# Altium schematic sheet Main.SchDoc: MCU - Top Sheet
size A3; Author: Eladio Delgado Mingorance; CompanyName: bq - Mundo Reader; Organization: bq - Mundo Reader; Revision: 1.4; SheetNumber: 1; SheetTotal: 10
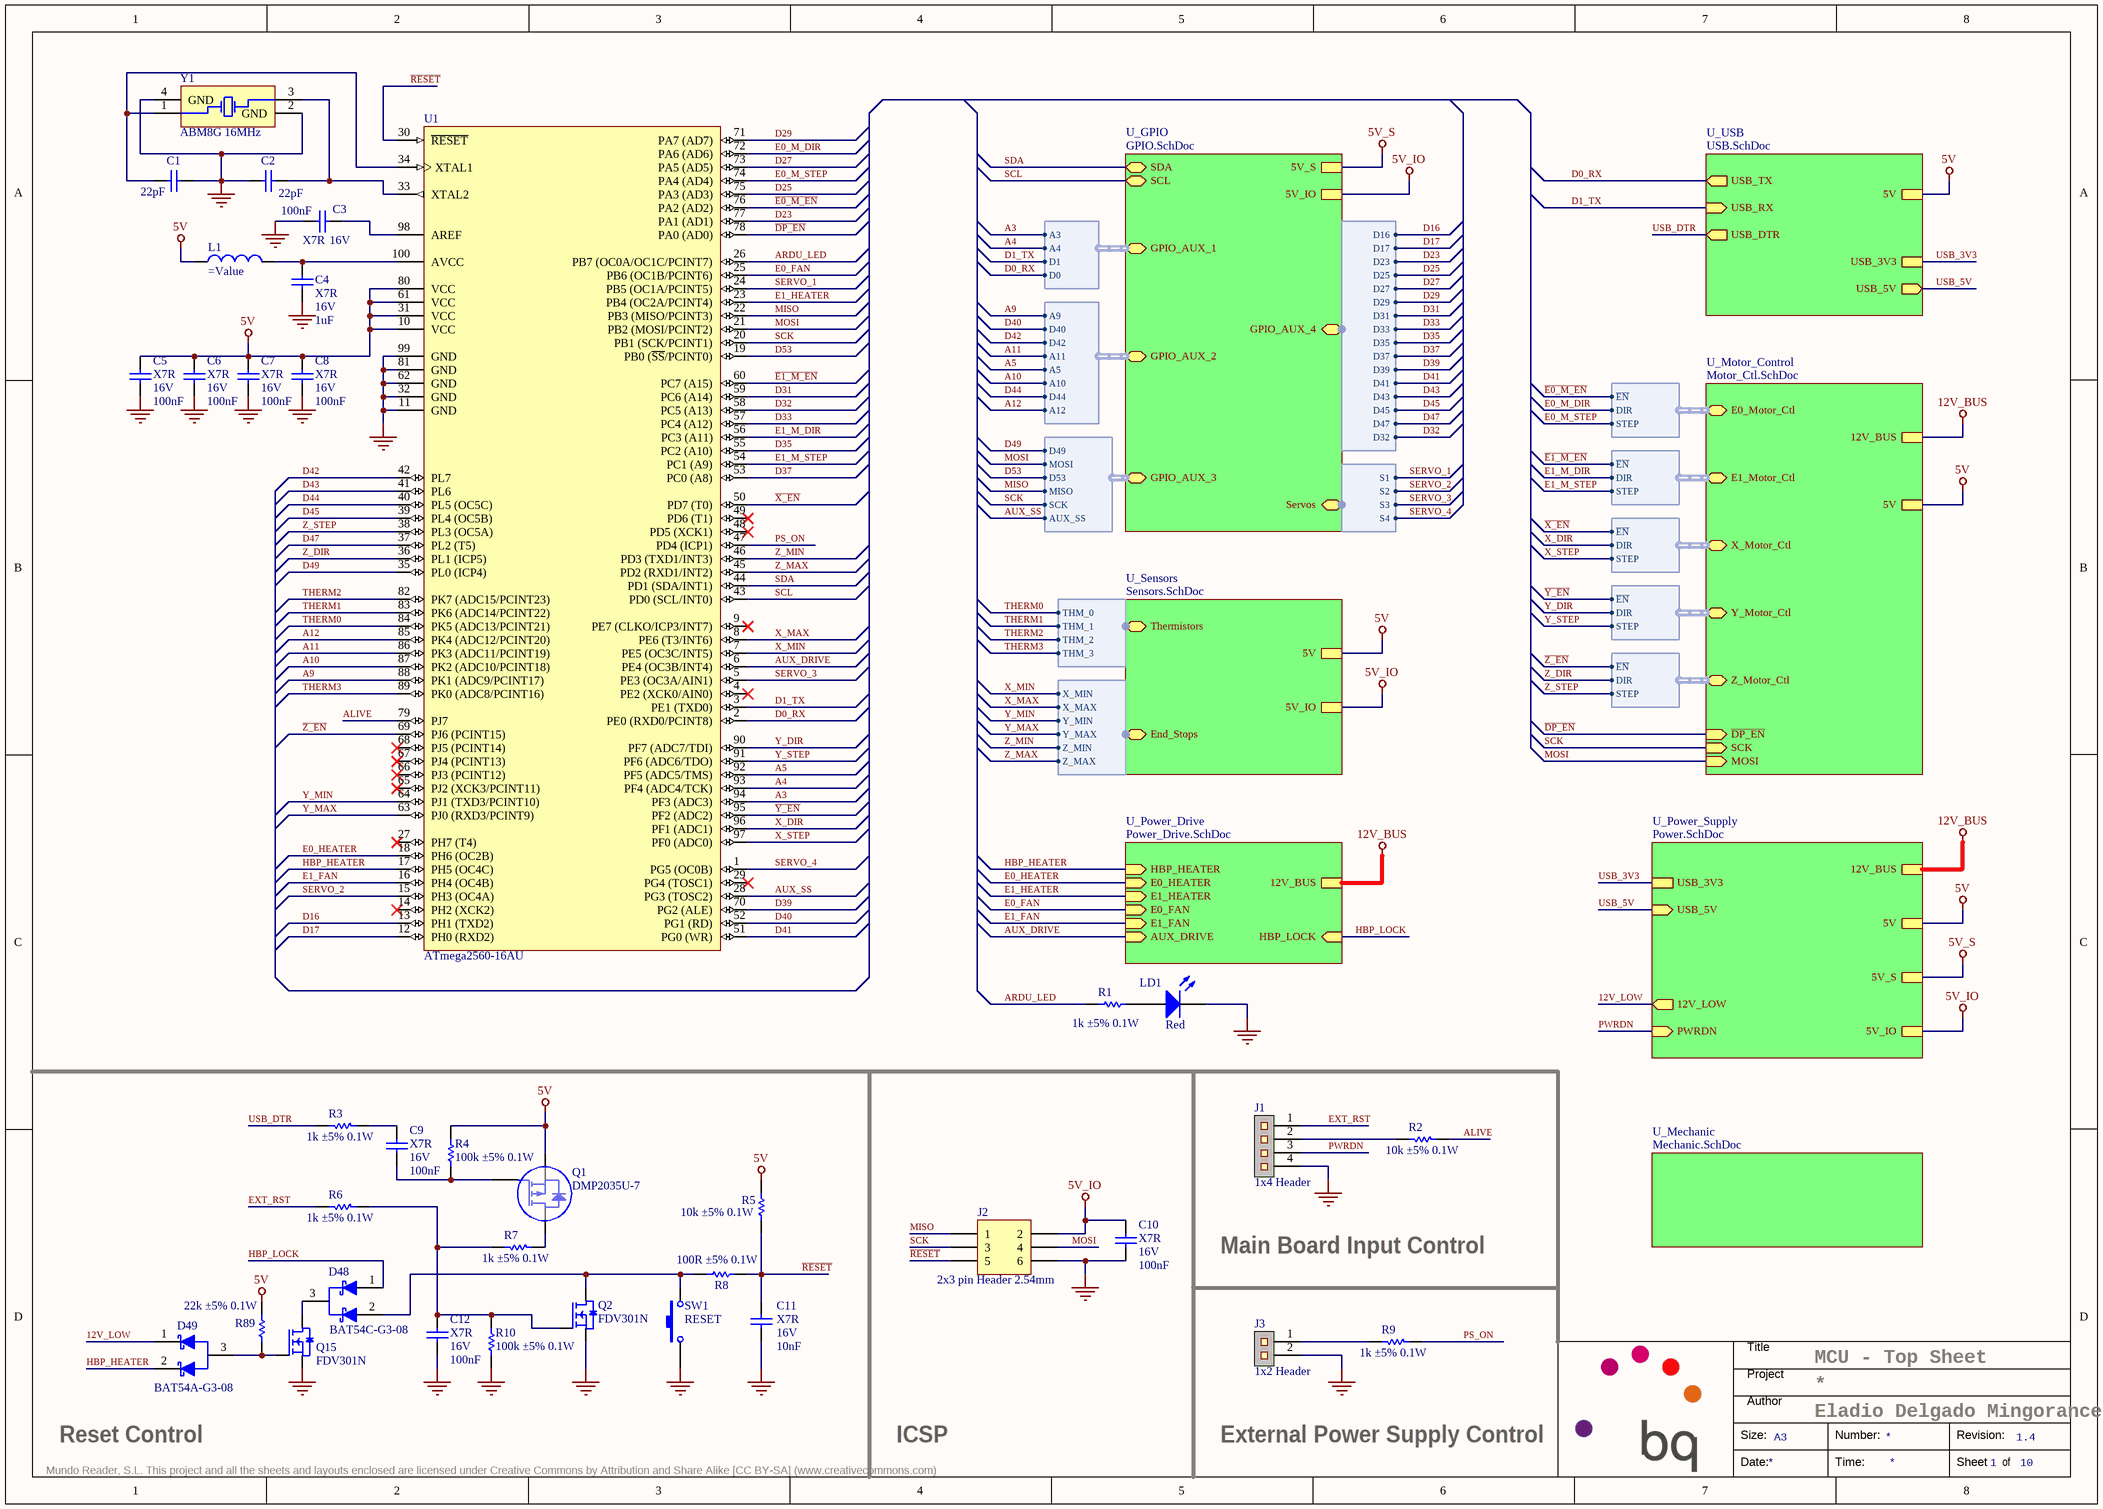
[diagram p0: Main.SchDoc]

## Parts
C1  Capacitance: 22pF  [C0603]  (hidden comment: Capacitor)
C2  Capacitance: 22pF  [C0603]  (hidden comment: Capacitor)
C3  Dielectric: X7R  Voltage: 16V  Capacitance: 100nF  [C0603]  (hidden comment: Capacitor)
C4  Dielectric: X7R  Voltage: 16V  Capacitance: 1uF  [C0603]  (hidden comment: Capacitor)
C5  Dielectric: X7R  Voltage: 16V  Capacitance: 100nF  [C0603]  (hidden comment: Capacitor)
C6  Dielectric: X7R  Voltage: 16V  Capacitance: 100nF  [C0603]  (hidden comment: Capacitor)
C7  Dielectric: X7R  Voltage: 16V  Capacitance: 100nF  [C0603]  (hidden comment: Capacitor)
C8  Dielectric: X7R  Voltage: 16V  Capacitance: 100nF  [C0603]  (hidden comment: Capacitor)
C9  Dielectric: X7R  Voltage: 16V  Capacitance: 100nF  [C0603]  (hidden comment: Capacitor)
C10  Dielectric: X7R  Voltage: 16V  Capacitance: 100nF  [C0603]  (hidden comment: Capacitor)
C11  Dielectric: X7R  Voltage: 16V  Capacitance: 10nF  [C0603]  (hidden comment: Capacitor)
C12  Dielectric: X7R  Voltage: 16V  Capacitance: 100nF  [C0603]  (hidden comment: Capacitor)
D48  BAT54C-G3-08  [SOT23-3]
D49  BAT54A-G3-08  [SOT23-3]
J1  1x4 Header  [1x4 MTE Straight Header 2.54mm]
J2  2x3 pin Header 2.54mm  [2x3 Pin Header 2.54]
J3  1x2 Header  [1x2 MTE Straight Header 2.54mm]
L1  (no value)  [L0805]
LD1  Red  [LED0603]
Q1  DMP2035U-7  [SOT23-3]
Q2  FDV301N  [SOT23-3]
Q15  FDV301N  [SOT23-3]
R1  value 1k ±5% 0.1W  [R0603]  (hidden comment: Resistor)
R2  value 10k ±5% 0.1W  [R0603]  (hidden comment: Resistor)
R3  value 1k ±5% 0.1W  [R0603]  (hidden comment: Resistor)
R4  value 100k ±5% 0.1W  [R0603]  (hidden comment: Resistor)
R5  value 10k ±5% 0.1W  [R0603]  (hidden comment: Resistor)
R6  value 1k ±5% 0.1W  [R0603]  (hidden comment: Resistor)
R7  value 1k ±5% 0.1W  [R0603]  (hidden comment: Resistor)
R8  value 100R ±5% 0.1W  [R0603]  (hidden comment: Resistor)
R9  value 1k ±5% 0.1W  [R0603]  (hidden comment: Resistor)
R10  value 100k ±5% 0.1W  [R0603]  (hidden comment: Resistor)
R89  value 22k ±5% 0.1W  [R0603]  (hidden comment: Resistor)
SW1  RESET  [SW_Vert_THT_7.5x6x6.5]
U1  ATmega2560-16AU  [TQFP100_05_MD]
Y1  ABM8G 16MHz  [ABM8G_3.2x2.5mm]

## Sub-sheets
U_GPIO = GPIO.SchDoc: GPIO_AUX_4 (harness GPIO_AUX_4), Servos (harness Servos), SDA (bidir), SCL (bidir), 5V_S, 5V_IO, GPIO_AUX_1 (harness GPIO_AUX_1), GPIO_AUX_2 (harness GPIO_AUX_2), GPIO_AUX_3 (harness GPIO_AUX_3)
U_Mechanic = Mechanic.SchDoc: no entries
U_Motor_Control = Motor_Ctl.SchDoc: E0_Motor_Ctl (harness Motor_Ctl), E1_Motor_Ctl (harness Motor_Ctl), X_Motor_Ctl (harness Motor_Ctl), Y_Motor_Ctl (harness Motor_Ctl), Z_Motor_Ctl (harness Motor_Ctl), ~{DP_EN} (in), SCK (in), MOSI (in), 12V_BUS, 5V
U_Power_Drive = Power_Drive.SchDoc: 12V_BUS, E0_HEATER (in), E1_HEATER (in), HBP_HEATER (in), E0_FAN (in), E1_FAN (in), AUX_DRIVE (in), HBP_LOCK (in)
U_Power_Supply = Power.SchDoc: 5V, 5V_S, 5V_IO, 12V_BUS, USB_3V3, USB_5V (in), PWRDN (in), 12V_LOW (out)
U_Sensors = Sensors.SchDoc: Thermistors (harness Thermistors), End_Stops (harness End_Stops), 5V, 5V_IO
U_USB = USB.SchDoc: USB_TX (out), USB_RX (in), USB_DTR (out), USB_3V3, USB_5V (out), 5V

## Harnesses
Motor_Ctl: ~{EN}, DIR, STEP
Thermistors: THM_0, THM_1, THM_2, THM_3
End_Stops: X_MIN, X_MAX, Y_MAX, Y_MIN, Z_MIN, Z_MAX
GPIO_AUX_4: D16, D17, D23, D25, D27, D29, D31, D33, D35, D37, D39, D41, D43, D45, D47, D32
Servos: S1, S2, S3, S4
GPIO_AUX_1: A3, A4, D0, D1
GPIO_AUX_2: A5, A10, D44, A12, A9, D40, D42, A11
GPIO_AUX_3: D49, MOSI, D53, MISO, SCK, AUX_SS

## Nets
5V: C5.2 C6.2 C7.2 C8.2 L1.1 Q1.2(S) R4.2 R5.2 R89.2 U1.10(VCC) U1.31(VCC) U1.61(VCC) U1.80(VCC) ; sheet U_Power_Supply/5V, sheet U_Motor_Control/5V, sheet U_Sensors/5V, sheet U_USB/5V
5V_IO: C10.2 J2.2 ; sheet U_Power_Supply/5V_IO, sheet U_Sensors/5V_IO, sheet U_GPIO/5V_IO
5V_S: sheet U_Power_Supply/5V_S, sheet U_GPIO/5V_S
12V_BUS: sheet U_Power_Supply/12V_BUS, sheet U_Motor_Control/12V_BUS, sheet U_Power_Drive/12V_BUS
GND: C1.1 C2.1 C3.2 C4.1 C5.1 C6.1 C7.1 C8.1 C10.1 C11.1 C12.1 J1.4 J2.6 J3.2 LD1.K Q2.2(S) Q15.2(S) R10.1 SW1.1 U1.11(GND) U1.32(GND) U1.62(GND) U1.81(GND) U1.99(GND) Y1.2(GND) Y1.4(GND)
12V_LOW: D49.1(A1) ; sheet U_Power_Supply/12V_LOW
~{DP_EN}: U1.78(PA0_(AD0)) ; sheet U_Motor_Control/~{DP_EN}
~{E0_M_EN}: U1.76(PA2_(AD2)) ; sheet U_Motor_Control/E0_Motor_Ctl.~{EN}
~{E1_M_EN}: U1.60(PC7_(A15)) ; sheet U_Motor_Control/E1_Motor_Ctl.~{EN}
~{RESET}: C11.2 J2.5 R5.1 R8.2 U1.30(~{RESET})
~{X_EN}: U1.50(PD7_(T0)) ; sheet U_Motor_Control/X_Motor_Ctl.~{EN}
~{Y_EN}: U1.95(PF2_(ADC2)) ; sheet U_Motor_Control/Y_Motor_Ctl.~{EN}
~{Z_EN}: U1.69(PJ6_(PCINT15)) ; sheet U_Motor_Control/Z_Motor_Ctl.~{EN}
A3: U1.94(PF3_(ADC3)) ; sheet U_GPIO/GPIO_AUX_1.A3
A4: U1.93(PF4_(ADC4/TCK)) ; sheet U_GPIO/GPIO_AUX_1.A4
A5: U1.92(PF5_(ADC5/TMS)) ; sheet U_GPIO/GPIO_AUX_2.A5
A9: U1.88(PK1_(ADC9/PCINT17)) ; sheet U_GPIO/GPIO_AUX_2.A9
A10: U1.87(PK2_(ADC10/PCINT18)) ; sheet U_GPIO/GPIO_AUX_2.A10
A11: U1.86(PK3_(ADC11/PCINT19)) ; sheet U_GPIO/GPIO_AUX_2.A11
A12: U1.85(PK4_(ADC12/PCINT20)) ; sheet U_GPIO/GPIO_AUX_2.A12
ALIVE: R2.1 U1.79(PJ7)
ARDU_LED: R1.1 U1.26(PB7_(OC0A/OC1C/PCINT7))
AUX_DRIVE: U1.6(PE4_(OC3B/INT4)) ; sheet U_Power_Drive/AUX_DRIVE
AUX_SS: U1.28(PG3_(TOSC2)) ; sheet U_GPIO/GPIO_AUX_3.AUX_SS
D0_RX: U1.2(PE0_(RXD0/PCINT8)) ; sheet U_USB/USB_TX, sheet U_GPIO/GPIO_AUX_1.D0
D1_TX: U1.3(PE1_(TXD0)) ; sheet U_USB/USB_RX, sheet U_GPIO/GPIO_AUX_1.D1
D16: U1.13(PH1_(TXD2)) ; sheet U_GPIO/GPIO_AUX_4.D16
D17: U1.12(PH0_(RXD2)) ; sheet U_GPIO/GPIO_AUX_4.D17
D23: U1.77(PA1_(AD1)) ; sheet U_GPIO/GPIO_AUX_4.D23
D25: U1.75(PA3_(AD3)) ; sheet U_GPIO/GPIO_AUX_4.D25
D27: U1.73(PA5_(AD5)) ; sheet U_GPIO/GPIO_AUX_4.D27
D29: U1.71(PA7_(AD7)) ; sheet U_GPIO/GPIO_AUX_4.D29
D31: U1.59(PC6_(A14)) ; sheet U_GPIO/GPIO_AUX_4.D31
D32: U1.58(PC5_(A13)) ; sheet U_GPIO/GPIO_AUX_4.D32
D33: U1.57(PC4_(A12)) ; sheet U_GPIO/GPIO_AUX_4.D33
D35: U1.55(PC2_(A10)) ; sheet U_GPIO/GPIO_AUX_4.D35
D37: U1.53(PC0_(A8)) ; sheet U_GPIO/GPIO_AUX_4.D37
D39: U1.70(PG2_(ALE)) ; sheet U_GPIO/GPIO_AUX_4.D39
D40: U1.52(PG1_(RD)) ; sheet U_GPIO/GPIO_AUX_2.D40
D41: U1.51(PG0_(WR)) ; sheet U_GPIO/GPIO_AUX_4.D41
D42: U1.42(PL7) ; sheet U_GPIO/GPIO_AUX_2.D42
D43: U1.41(PL6) ; sheet U_GPIO/GPIO_AUX_4.D43
D44: U1.40(PL5_(OC5C)) ; sheet U_GPIO/GPIO_AUX_2.D44
D45: U1.39(PL4_(OC5B)) ; sheet U_GPIO/GPIO_AUX_4.D45
D47: U1.37(PL2_(T5)) ; sheet U_GPIO/GPIO_AUX_4.D47
D49: U1.35(PL0_(ICP4)) ; sheet U_GPIO/GPIO_AUX_3.D49
D53: U1.19(PB0_(~{SS}/PCINT0)) ; sheet U_GPIO/GPIO_AUX_3.D53
E0_FAN: U1.25(PB6_(OC1B/PCINT6)) ; sheet U_Power_Drive/E0_FAN
E0_HEATER: U1.18(PH6_(OC2B)) ; sheet U_Power_Drive/E0_HEATER
E0_M_DIR: U1.72(PA6_(AD6)) ; sheet U_Motor_Control/E0_Motor_Ctl.DIR
E0_M_STEP: U1.74(PA4_(AD4)) ; sheet U_Motor_Control/E0_Motor_Ctl.STEP
E1_FAN: U1.16(PH4_(OC4B)) ; sheet U_Power_Drive/E1_FAN
E1_HEATER: U1.23(PB4_(OC2A/PCINT4)) ; sheet U_Power_Drive/E1_HEATER
E1_M_DIR: U1.56(PC3_(A11)) ; sheet U_Motor_Control/E1_Motor_Ctl.DIR
E1_M_STEP: U1.54(PC1_(A9)) ; sheet U_Motor_Control/E1_Motor_Ctl.STEP
EXT_RST: J1.1 R6.2
HBP_HEATER: D49.2(A2) U1.17(PH5_(OC4C)) ; sheet U_Power_Drive/HBP_HEATER
HBP_LOCK: D48.1(A1) ; sheet U_Power_Drive/HBP_LOCK
MISO: J2.1 U1.22(PB3_(MISO/PCINT3)) ; sheet U_GPIO/GPIO_AUX_3.MISO
MOSI: J2.4 U1.21(PB2_(MOSI/PCINT2)) ; sheet U_Motor_Control/MOSI, sheet U_GPIO/GPIO_AUX_3.MOSI
PS_ON: R9.1 U1.47(PD4_(ICP1))
PWRDN: J1.3 ; sheet U_Power_Supply/PWRDN
SCK: J2.3 U1.20(PB1_(SCK/PCINT1)) ; sheet U_Motor_Control/SCK, sheet U_GPIO/GPIO_AUX_3.SCK
SCL: U1.43(PD0_(SCL/INT0)) ; sheet U_GPIO/SCL
SDA: U1.44(PD1_(SDA/INT1)) ; sheet U_GPIO/SDA
SERVO_1: U1.24(PB5_(OC1A/PCINT5)) ; sheet U_GPIO/Servos.S1
SERVO_2: U1.15(PH3_(OC4A)) ; sheet U_GPIO/Servos.S2
SERVO_3: U1.5(PE3_(OC3A/AIN1)) ; sheet U_GPIO/Servos.S3
SERVO_4: U1.1(PG5_(OC0B)) ; sheet U_GPIO/Servos.S4
THERM0: U1.84(PK5_(ADC13/PCINT21)) ; sheet U_Sensors/Thermistors.THM_0
THERM1: U1.83(PK6_(ADC14/PCINT22)) ; sheet U_Sensors/Thermistors.THM_1
THERM2: U1.82(PK7_(ADC15/PCINT23)) ; sheet U_Sensors/Thermistors.THM_2
THERM3: U1.89(PK0_(ADC8/PCINT16)) ; sheet U_Sensors/Thermistors.THM_3
USB_3V3: sheet U_Power_Supply/USB_3V3, sheet U_USB/USB_3V3
USB_5V: sheet U_Power_Supply/USB_5V, sheet U_USB/USB_5V
USB_DTR: R3.2 ; sheet U_USB/USB_DTR
X_DIR: U1.96(PF1_(ADC1)) ; sheet U_Motor_Control/X_Motor_Ctl.DIR
X_MAX: U1.8(PE6_(T3/INT6)) ; sheet U_Sensors/End_Stops.X_MAX
X_MIN: U1.7(PE5_(OC3C/INT5)) ; sheet U_Sensors/End_Stops.X_MIN
X_STEP: U1.97(PF0_(ADC0)) ; sheet U_Motor_Control/X_Motor_Ctl.STEP
Y_DIR: U1.90(PF7_(ADC7/TDI)) ; sheet U_Motor_Control/Y_Motor_Ctl.DIR
Y_MAX: U1.63(PJ0_(RXD3/PCINT9)) ; sheet U_Sensors/End_Stops.Y_MAX
Y_MIN: U1.64(PJ1_(TXD3/PCINT10)) ; sheet U_Sensors/End_Stops.Y_MIN
Y_STEP: U1.91(PF6_(ADC6/TDO)) ; sheet U_Motor_Control/Y_Motor_Ctl.STEP
Z_DIR: U1.36(PL1_(ICP5)) ; sheet U_Motor_Control/Z_Motor_Ctl.DIR
Z_MAX: U1.45(PD2_(RXD1/INT2)) ; sheet U_Sensors/End_Stops.Z_MAX
Z_MIN: U1.46(PD3_(TXD1/INT3)) ; sheet U_Sensors/End_Stops.Z_MIN
Z_STEP: U1.38(PL3_(OC5A)) ; sheet U_Motor_Control/Z_Motor_Ctl.STEP
NetC1_2: C1.2 U1.34(XTAL1) Y1.1(OSC1)
NetC2_2: C2.2 U1.33(XTAL2) Y1.3(OSC2)
NetC3_1: C3.1 U1.98(AREF)
NetC4_2: C4.2 L1.2 U1.100(AVCC)
NetC9_1: C9.1 Q1.1(G) R4.1
NetC9_2: C9.2 R3.1
NetC12_2: C12.2 Q2.1(G) R6.1 R7.2 R10.2
NetD48_2: D48.2(A2) Q2.3(D) R8.1 SW1.2
NetD48_3: D48.3(K) Q15.3(D)
NetD49_3: D49.3(K) Q15.1(G) R89.1
NetJ1_2: J1.2 R2.2
NetJ3_1: J3.1 R9.2
NetLD1_A: LD1.A R1.2
NetQ1_3: Q1.3(D) R7.1

Not connected (* = marked no-connect by the designer): U1 4(PE2_(XCK0/AIN0))* 9(PE7_(CLKO/ICP3/INT7))* 14(PH2_(XCK2))* 27(PH7_(T4))* 29(PG4_(TOSC1))* 48(PD5_(XCK1))* 49(PD6_(T1))* 65(PJ2_(XCK3/PCINT11))* 66(PJ3_(PCINT12))* 67(PJ4_(PCINT13))* 68(PJ5_(PCINT14))*

## Notes on the sheet
- Main Board Input Control
- Reset Control
- ICSP
- External Power Supply Control
- Title
- Project
- Size:
- Author
- A3
- Number:
- Revision:
- Mundo Reader, S.L. This project and all the sheets and layouts enclosed are licensed under Creative Commons by Attribution and Share Alike [CC BY-SA] (www.creativecommons.com)
- Date:
- Time:
- Sheet
- of

## Library data of the parts
C1 C2 = C0603_22pF_16V_±10%: Manufacturer: Kemet; Value: 22pF ±10% 16V; Dielectric: C0G; Voltage: 16V; Tolerance: ±10%; OrderingCode: C0603C220K4GAC; Temp_ Max: 125; Temp_ Min: -55; Part Number: C0603_22pF_16V_±10%; Price (€): 0,015
C3 C5-C10 C12 = C0603_100nF_16V_±10%: Manufacturer: Kemet; Value: 100nF ±10% 16V; Tolerance: ±10%; OrderingCode: C0603C104K4RAC; Temp_ Max: 125; Temp_ Min: -55; Part Number: C0603_100nF_16V_±10%; Price (€): 0,012
C4 = C0603_1uF_16V_±10%_X7R: Capacitor SMD; Manufacturer: TDK; Value: 1uF ±10% 16V; Tolerance: ±10%; OrderingCode: C1608X7R1C105K080AC; Temp_ Max: 125; Temp_ Min: -55; OrderingCode 2: C0603C105K4RACTU; Part Number: C0603_1uF_16V_±10%_X7R; Price (€): 0,018; Manufacturer 2: Kemet
C11 = C0603_10nF_16V_±10%: Capacitor SMD; Manufacturer: Kemet; Value: 10nF ±10% 16V; Tolerance: ±10%; OrderingCode: C0603C103K4RAC; Temp_ Max: 125; Temp_ Min: -55; Part Number: C0603_10nF_16V_±10%; Price (€): 0,035
D48 = BAT54C: Dual Schottky Diode Common Cathode; Part Number: BAT54C; Manufacturer: Vishay; Ifor: 200mA; Vrrm: 30V; Ifsm: 600mA; Vf: 0,8V; Temp_ Max: 125; Temp_ Min: -55; Value: 200mA 30V; OrderingCode: BAT54C-G3-08; Price (€): 0,042; Manufacturer 2: Fairchild; OrderingCode 2: BAT54C
D49 = BAT54A: Dual Schottky Diode Common Anode; Part Number: BAT54A; Manufacturer: Vishay; Ifor: 200mA; Vrrm: 30V; Ifsm: 600mA; Vf: 0,8V; Temp_ Max: 125; Temp_ Min: -55; Value: 200mA 30V; OrderingCode: BAT54A-G3-08; Price (€): 0,042
J1 = CON_MTE_HDR_THT2.54_4: 1x4 MTE Straight Header 2.54mm; Manufacturer: TE Connectivity; OrderingCode: 5-104362-3; Temp_ Max: 105; Temp_ Min: -65; Value: 4; Part Number: CON_MTE_HDR_THT2.54_4; Price (€): 0,466; Supplier: Abacus
J2 = CON_DPH_THT2.54_6: Connector, 6 pin Dual Header 2.54mm; Manufacturer: Samtec; OrderingCode: TSW-103-07-T-D; Temp_ Max: 125; Temp_ Min: -40; OrderingCode 2: 613 006 211 21; Value: 6; Pitch: 2.54mm; Part Number: CON_DPH_THT2.54_6; Supplier: Samtec; Price (€): 0,238; Manufacturer 2: Würth Elektronik
J3 = CON_MTE_HDR_THT2.54_2: 1x2 MTE Straight Header 2.54mm; Manufacturer: TE Connectivity; OrderingCode: 5-104362-1; Temp_ Max: 105; Temp_ Min: -65; Value: 2; Part Number: CON_MTE_HDR_THT2.54_2; Price (€): 0,382; Supplier: Abacus
L1 = 10uH_0,1A: Manufacturer: muRata; L: 10uH; Rdc: 0,60R; Current: 0,1A; OrderingCode: LQM21FN100M70L; Temp_ Max: 125; Temp_ Min: -55; Value: 10uH 0,1A; Part Number: 10uH_0,1A; Price (€): 0,062
LD1 = HSMH-C190: Light Emitting Diode; Manufacturer: Avago Technologies; Temp_ Max: 85; Temp_ Min: -40; OrderingCode 2: LG Q971-KN-1; Part Number: HSMH-C190; OrderingCode: HSMH-C190; Price (€): 0,064; Manufacturer 2: OSRAM Opto; Value: Red
Q1 = DMP2035U: Mosfet Channel P Enhancement Mode; Manufacturer: Diodes Incorporated; Vds: 20V; Vgss: 8V; Id: 3,6A; Temp_ Max: 150; Temp_ Min: -55; Part Number: DMP2035U; OrderingCode: DMP2035U-7; Supplier: Silica; Price (€): 0,08
Q2 Q15 = FDV301N: Mosfet Channel N Enhancement Mode; Manufacturer: Fairchild Semiconductor; Vds: 25V; Vgss: 8V; Id: 0,22A; Temp_ Max: 150; Temp_ Min: -55; OrderingCode 2: DMG301NU-13; Part Number: FDV301N; OrderingCode: FDV301N; Price (€): 0,026; Manufacturer 2: Diode
R1 R3 R6 R7 R9 = R0603_1k_0.1W_±5%: Manufacturer: Vishay; Tolerance: ±5%; OrderingCode: CRCW06031K00JN; Power: 0.1W; Resistance: 1k; Temp_ Max: 155; Temp_ Min: -55; PackageDescription: SMD; Part Number: R0603_1k_0.1W_±5%; Price (€): 0,003
R2 R5 = R0603_10k_0.1W_±5%: Manufacturer: Vishay; Tolerance: ±5%; OrderingCode: CRCW060310K0JN; Power: 0.1W; Resistance: 10k; Temp_ Max: 155; Temp_ Min: -55; PackageDescription: SMD; Part Number: R0603_10k_0.1W_±5%; Price (€): 0,003
R4 R10 = R0603_100k_0.1W_±5%: Manufacturer: Vishay; Tolerance: ±5%; OrderingCode: CRCW0603100KJN; Power: 0.1W; Resistance: 100k; Temp_ Max: 155; Temp_ Min: -55; PackageDescription: SMD; Part Number: R0603_100k_0.1W_±5%; Price (€): 0,003
R8 = R0603_100R_0.1W_±5%: Resistor, SMD; Manufacturer: Vishay; Tolerance: ±5%; OrderingCode: CRCW0603100RJN; Power: 0.1W; Resistance: 100R; Temp_ Max: 155; Temp_ Min: -55; PackageDescription: SMD; Part Number: R0603_100R_0.1W_±5%; Price (€): 0,003
R89 = R0603_22k_0.1W_±5%: Resistor, SMD; Manufacturer: Vishay; Tolerance: ±5%; OrderingCode: CRCW060322K0JN; Power: 0.1W; Resistance: 22k; Temp_ Max: 155; Temp_ Min: -55; PackageDescription: SMD; Part Number: R0603_22k_0.1W_±5%; Price (€): 0,003
SW1 = SW Vertical THT: Micro miniature pushbutton surface Switch; Manufacturer: C&K Components; OrderingCode: PTS645VL39-2 LFS; Temp_ Max: 60; Temp_ Min: -20; Part Number: SW Vertical THT; Supplier: Abacus; Price (€): 0,104
U1 = Atmega2560: 8-bit AVR Microcontroller, 4.5-5.5V, 16MHz, 256KB Flash, 4KB EEPROM, 8KB SRAM, 86 GPIO pins, 100-pin TQFP, Industrial Grade (-40°C to 85°C), Pb-Free; Manufacturer: Atmel; Temp_ Max: 85; Temp_ Min: -40; Part Number: Atmega2560; OrderingCode: ATmega2560-16AU; Supplier: EBV; Price (€): 8,36
Y1 = ABM8G 16MHz: Crystal; Manufacturer: Abracon; Tolerance: ±20ppm; Load Capacitance: 18pF; OrderingCode: ABM8G-16.000MHZ-18-D2Y-T; Temp_ Max: 85; Temp_ Min: -40; Part Number: ABM8G 16MHz; Price (€): 0,437; Value: 16MHz